# EAGLE design op_amp (EAGLE 8.0.1)

## Sheet 1 of 2
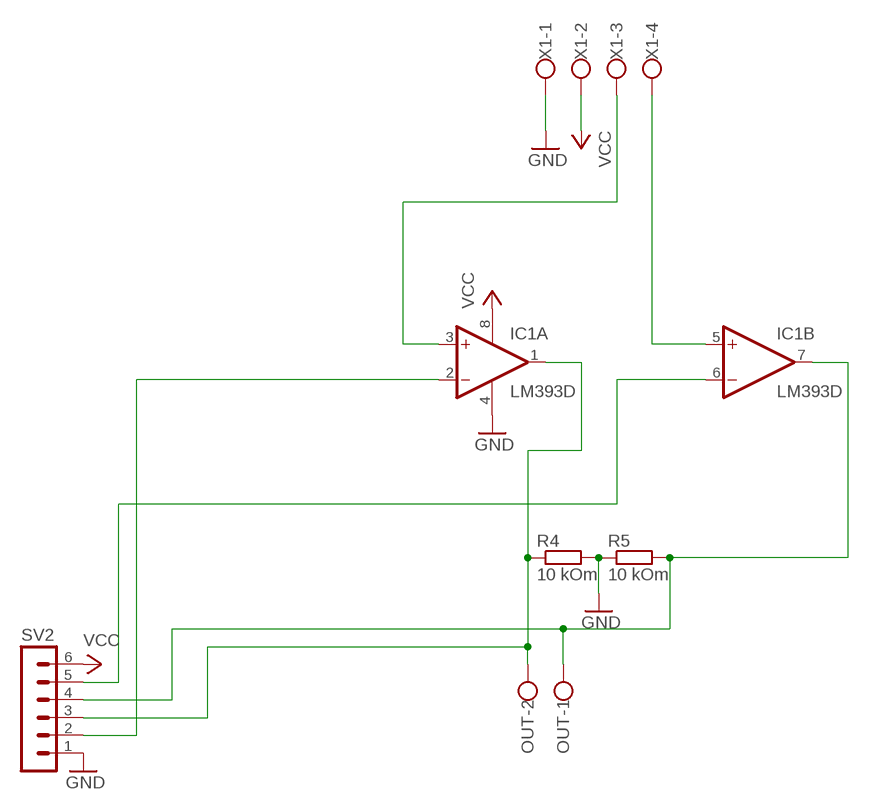
[diagram p0: schematic, sheet 1]

### Parts
IC1  LM393D  [SO08]
OUT  W237-102  [W237-102]
R4  10 kOm  R-EU_0207/7  [0207/7]
R5  10 kOm  R-EU_0207/7  [0207/7]
SV2  MA06-1  [MA06-1]
X1  W237-4  [W237-4]

### Nets
GND: IC1.4(P:V-) R4.2 R5.1 SV2.1 X1.1 ; also sheet 2
N$1: IC1.6(B:-IN) SV2.5
N$6: IC1.1(A:OUT) OUT.2 R4.1 SV2.3
N$8: IC1.3(A:+IN) X1.3
N$9: IC1.5(B:+IN) X1.4
N$10: IC1.2(A:-IN) SV2.2
N$11: IC1.7(B:OUT) OUT.1 R5.2 SV2.4
VCC: IC1.8(P:V+) SV2.6 X1.2 ; also sheet 2

## Sheet 2 of 2
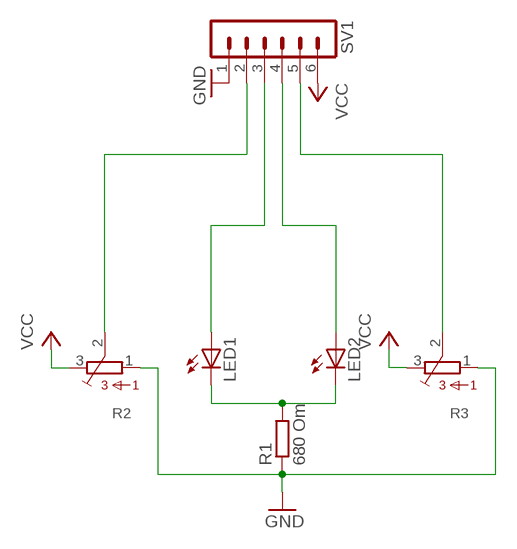
[diagram p1: schematic, sheet 2]

### Parts
LED1  LED3MM  [LED3MM]
LED2  LED3MM  [LED3MM]
R1  680 Om  R-EU_0207/7  [0207/7]
R2  3362P  [3362P]
R3  3362P  [3362P]
SV1  MA06-1  [MA06-1]

### Nets
GND: R1.1 R2.1 R3.1 SV1.1 ; also sheet 1
N$2: LED1.A SV1.3
N$3: LED1.K(C) LED2.K(C) R1.2
N$4: LED2.A SV1.4
N$7: R3.2 SV1.5
N$13: R2.2 SV1.2
VCC: R2.3 R3.3 SV1.6 ; also sheet 1

## Library data of the parts
IC1 = linear4:LM393: COMPARATOR
LED1 LED2 = led:LED: LED OSRAM: - CHIPLED LG R971, LG N971, LY N971, LG Q971, LY Q971, LO R971, LY R971 LH N974, LH R974 LS Q976, LO Q976, LY Q976 LO Q996 - Hyper CHIPLED LW Q18S LB Q993, LB Q99A, LB R99A - SideLED LS A670, LO A670, LY A670, LG A670, LP A670 LB A673, LV A673, LT A673, LW A673 LH A674 LY A675 LS A676, LA A676, LO A676, LY A676, LW A676 LS A679, LY A679, LG A679 - Hyper Micro SIDELED® LS Y876, LA Y876, LO Y876, LY Y876 LT Y87S - SmartLED LW L88C, LW L88S LB L89C, LB L89S, LG L890 LS L89K, LO L89K, LY L89K LS L896, LA L896, LO L896, LY L896 - TOPLED LS T670, LO T670, LY T670, LG T670, LP T670 LSG T670, LSP T670, LSY T670, LOP T670, LYG T670 LG T671, LOG T671, LSG T671 LB T673, LV T673, LT T673, LW T673 LH T674 LS T676, LA T676, LO T676, LY T676, LB T676, LH T676, LSB T676, LW T676 LB T67C, LV T67C, LT T67C, LS T67K, LO T67K, LY T67K, LW E67C LS E67B, LA E67B, LO E67B, LY E67B, LB E67C, LV E67C, LT E67C LW T67C LS T679, LY T679, LG T679 LS T770, LO T770, LY T770, LG T770, LP T770 LB T773, LV T773, LT T773, LW T773 LH T774 LS E675, LA E675, LY E675, LS T675 LS T776, LA T776, LO T776, LY T776, LB T776 LHGB T686 LT T68C, LB T68C - Hyper Mini TOPLED® LB M676 - Mini TOPLED Santana® LG M470 LS M47K, LO M47K, LY M47K Source: http://www.osram.convergy.de LUXEON: - LUMILED® LXK2-PW12-R00, LXK2-PW12-S00, LXK2-PW14-U00, LXK2-PW14-V00 LXK2-PM12-R00, LXK2-PM12-S00, LXK2-PM14-U00 LXK2-PE12-Q00, LXK2-PE12-R00, LXK2-PE12-S00, LXK2-PE14-T00, LXK2-PE14-U00 LXK2-PB12-K00, LXK2-PB12-L00, LXK2-PB12-M00, LXK2-PB14-N00, LXK2-PB14-P00, LXK2-PB14-Q00 LXK2-PR12-L00, LXK2-PR12-M00, LXK2-PR14-Q00, LXK2-PR14-R00 LXK2-PD12-Q00, LXK2-PD12-R00, LXK2-PD12-S00 LXK2-PH12-R00, LXK2-PH12-S00 LXK2-PL12-P00, LXK2-PL12-Q00, LXK2-PL12-R00 Source: www.luxeon.com KINGBRIGHT: KA-3528ASYC Source: www.kingbright.com
OUT = con-wago-500:W237-102: WAGO SCREW CLAMP; MPN: 237-102; OC_FARNELL: unknown; OC_NEWARK: 70K9898
R1 R4 R5 = resistor:R-EU_: RESISTOR, European symbol
R2 R3 = bourns:3362: 3362 Series 1/4" Square Trimmer
SV1 SV2 = con-lstb:MA06-1: PIN HEADER; OC_FARNELL: unknown; OC_NEWARK: unknown
X1 = con-wago-500:W237-4: WAGO SCREW CLAMP; OC_FARNELL: unknown; OC_NEWARK: unknown

## Board
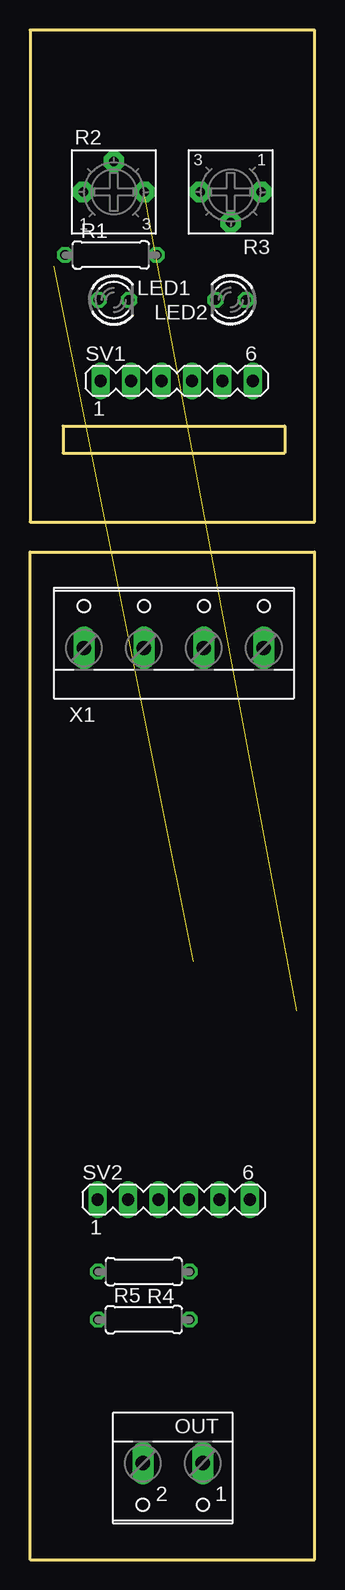
[diagram p2: board, top side]
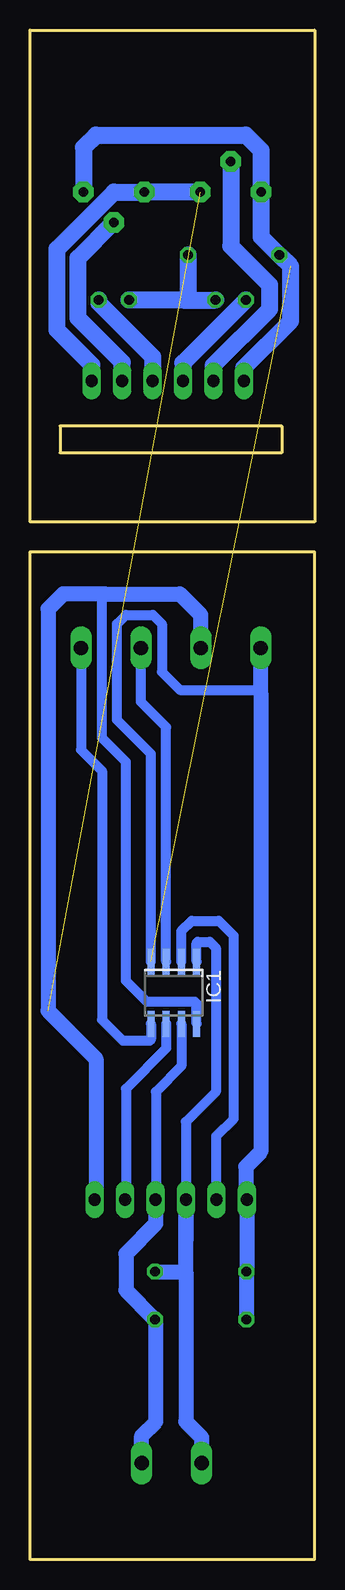
[diagram p3: board, bottom side, seen from below]

Size 23.75 x 127.5 mm. Coordinates in mm from the lower left corner, seen from the top.
Outline: 0,84 23.75,84 23.75,0 0,0 0,84
Outline: 0,86.5 23.75,86.5 23.75,127.5 0,127.5 0,86.5
Outline: 2.75,94.5 21.25,94.5 21.25,92.25 2.75,92.25 2.75,94.5
Copper layers (1*16): Top 0.035mm / dielectric 1.5mm / Bottom 0.035mm
Design rules "default": minimum track width 10mil, minimum drill 24mil, track to track 8mil, track to pad 8mil, pad to pad 8mil, via to via 8mil, smd to smd 8mil, copper to edge 40mil, drill to drill 8mil, minimum pad ring 10mil, minimum via ring 8mil, stop-mask expansion 4mil, vias tented up to drill 0mil, thermal gap 10mil

### Footprints (pad centres in the part's own frame; a part is rotated, then mirrored left to right if it is on the bottom)
SO08 = smd 0.6 x 2.2: 1 -1.905,-2.6; 2 -0.635,-2.6; 3 0.635,-2.6; 4 1.905,-2.6; 5 1.905,2.6; 6 0.635,2.6; 7 -0.635,2.6; 8 -1.905,2.6
LED3MM = drill 0.813 octagon: A -1.27,0; K 1.27,0
W237-102 = drill 1.194 long: 1 -2.5,-1.27; 2 2.5,-1.27
0207/7 = drill 0.813 octagon: 1 -3.81,0; 2 3.81,0
3362P = drill 0.813 pad 1.676 octagon: 1 -2.54,0; 2 0,2.54; 3 2.54,0
MA06-1 = drill 1.016 long: 1 -6.35,0; 2 -3.81,0; 3 -1.27,0; 4 1.27,0; 5 3.81,0; 6 6.35,0
W237-4 = drill 1.194 long: 1 -7.5,-1.27; 2 -2.5,-1.27; 3 2.5,-1.27; 4 7.5,-1.27

### Placement (x,y rotation side)
IC1  11.75,47.25 180 bottom
LED1  7,105 0 top
LED2  16.75,105 180 top
OUT  11.92,6.76 180 top
R1  6.75,108.75 0 top
R2  7,114 0 top
R3  16.75,114 180 top
R4  9.5,24 180 top
R5  9.5,20 0 top
SV1  12.25,98.25 0 top
SV2  12,30 0 top
X1  12,77.25 0 top

### Tracks (layer width: path | path; a pad name or v marks a point on that pad's centre or on a via)
GND  (1 unrouted)
  Bottom 0.813: IC1.4 13.66,67.16 16.5,70 16.5,78 15.75,78.75 13.5,78.75 12.75,78 12.75,74 11.25,72.5 4.75,72.5 4.5,72.25
  Bottom 1.27: X1.1 4.5,72.25 4.5,34 5.75,32.75 5.75,30.1 SV2.1 5.65,24.04 R4.2 R5.1
  Bottom 1.422: R3.1 19.29,117.71 18.25,118.75 5.75,118.75 4.46,117.46 R2.1 4.46,110.27 R1.1 2,107.81 2,103.25 5.9,99.35 SV1.1
N$1
  Bottom 0.813: IC1.6 12.38,42.62 15.75,39.25 15.75,30.06 SV2.5
N$2
  Bottom 1.422: LED1.A 5.75,105 11,99.75 11,98.27 SV1.3
N$3
  Bottom 1.422: 11,105 LED1.K | 11,105 LED2.K | R1.2 10.56,105.44 11,105
N$4
  Bottom 1.422: SV1.4 13.52,100.27 18.02,104.77 LED2.A
N$6
  Bottom 0.813: IC1.1 9.84,51.41 9.75,51.5 8.75,51.5 8.25,51 8.25,39 10.75,36.5 10.75,30.02 SV2.3
  Bottom 1.27: 10.73,26.58 SV2.3 10.73,24 | OUT.2 9.42,10.17 10.73,11.48 10.73,24 | R4.1 10.73,24
N$7
  Bottom 1.422: R3.2 16.79,111.46 19.75,108.5 19.75,103.5 16.06,99.81 SV1.5
N$8
  Bottom 0.813: IC1.3 12.38,69.39 14.5,71.5 X1.3
N$9
  Bottom 0.813: X1.4 19.5,67.5 17.75,65.75 17.75,45 16,43.25 13.75,43.25 13.66,43.34 IC1.5
N$10
  Bottom 0.813: SV2.2 8.19,35.31 6.75,36.75 6.75,52 8,53.25 10.25,53.25 11.12,52.38 IC1.2
N$11
  Bottom 0.813: IC1.7 11.12,41.13 13.25,39 13.25,30.02 SV2.4
  Bottom 1.27: SV2.4 13.27,27.98 15.75,25.5 15.75,22.44 R5.2 13.25,19.94 13.25,11.5 14.42,10.33 OUT.1
N$13
  Bottom 1.422: R2.2 7,109.5 3.75,106.25 3.75,104.25 8.44,99.56 SV1.2
VCC  (1 unrouted)
  Bottom 0.406: 9.75,44.75 IC1.8
  Bottom 0.813: 9.5,77.5 X1.2 | IC1.8 9.84,46.34 10,46.5 14,46.5 15.75,48.25 15.75,66.5 17.75,68.5 17.75,80.25 17.5,80.5
  Bottom 1.27: X1.2 9.5,78.75 11.25,80.5 17.5,80.5 21,80.5 22.25,79.25 22.25,45.75 18.25,41.75 18.25,30.1 SV2.6
  Bottom 1.422: R2.3 R3.3 16.75,114 21.5,109.25 21.5,102.5 18.6,99.6 SV1.6